# Altium schematic sheet PSD_IO.SchDoc
size A; SheetNumber: 2; SheetTotal: 2
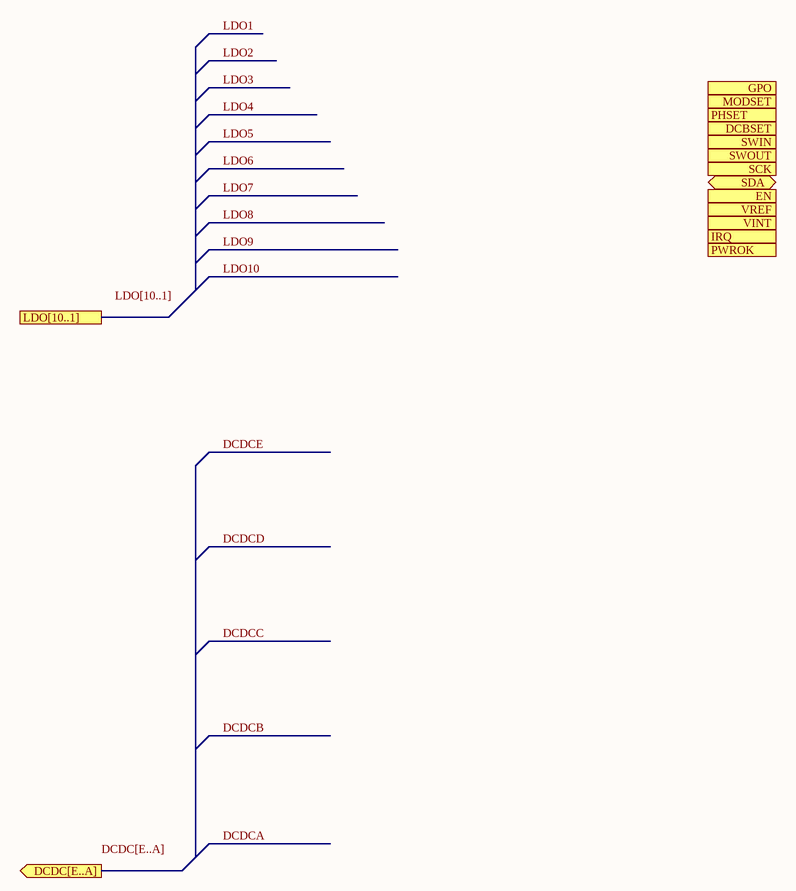
[diagram p0: PSD_IO.SchDoc]

## Ports
DCBSET (out), DCDC[E..A] (out), EN (out), GPO (out), IRQ (out), LDO[10..1], MODSET (out), PHSET (out), PWROK (out), SCK (in), SDA (bidir), SWIN (out), SWOUT (out), VINT (out), VREF (out)

## Buses and harness runs
bus LDO[10..1]

## Notes on the sheet
- Labels drawn without touching a wire or pin: DCDC[E..A], LDO[10..1]